# EAGLE schematic 5servoBreakoutSchematic (EAGLE 9.7.0)
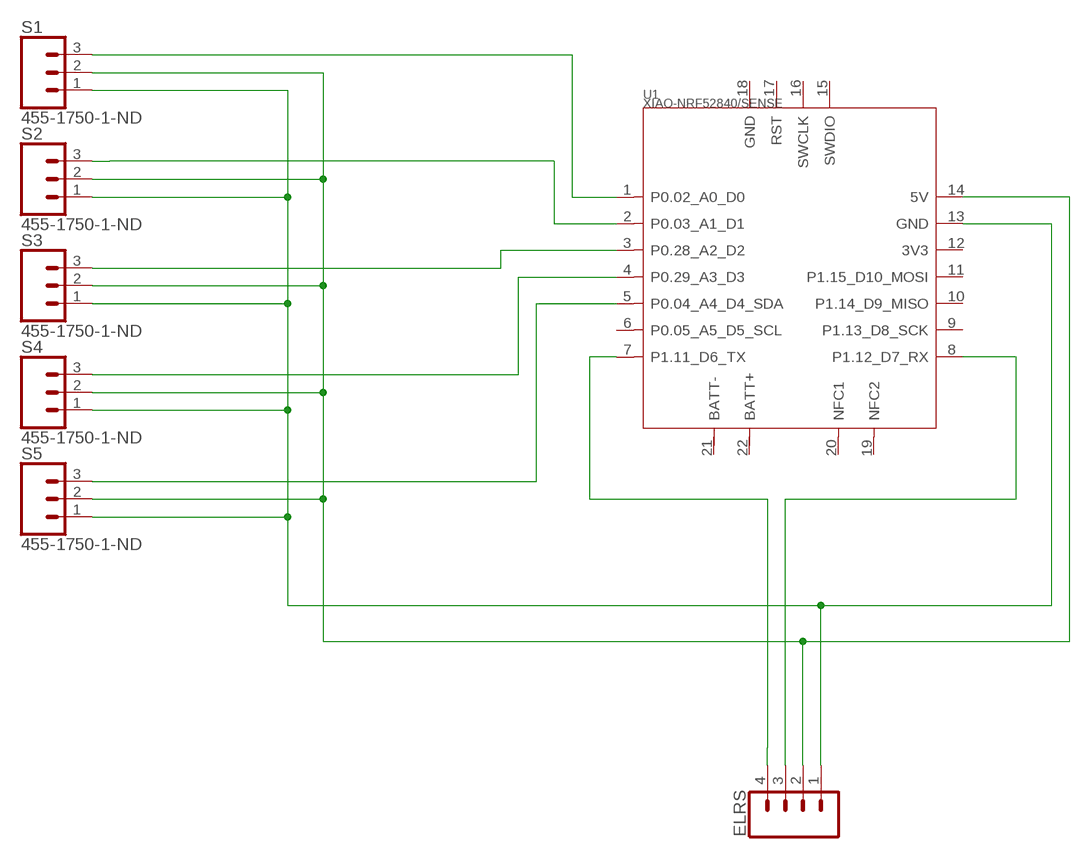
[diagram p0: schematic, sheet 1]

## Parts
ELRS  CONN_04PTH  [1X04]
S1  455-1750-1-ND  CONN_03  [1X03]
S2  455-1750-1-ND  CONN_03  [1X03]
S3  455-1750-1-ND  CONN_03  [1X03]
S4  455-1750-1-ND  CONN_03  [1X03]
S5  455-1750-1-ND  CONN_03  [1X03]
U1  XIAO-NRF52840/SENSE  [XIAO-NRF52840/SENSE-MODULE14P-2.54-21X17.8MM]

## Nets
5V [power]: ELRS.2 S1.2 S2.2 S3.2 S4.2 S5.2 U1.14(5V)
GND [power]: ELRS.1 S1.1 S2.1 S3.1 S4.1 S5.1 U1.13(GND)
N$1 [power]: S4.3 U1.4(P0.29_A3_D3)
N$2 [signal]: ELRS.3 U1.8(P1.12_D7_RX)
N$3 [signal]: ELRS.4 U1.7(P1.11_D6_TX)
N$4 [signal]: S1.3 U1.1(P0.02_A0_D0)
N$5 [signal]: S2.3 U1.2(P0.03_A1_D1)
N$6 [signal]: S3.3 U1.3(P0.28_A2_D2)
N$7 [power]: S5.3 U1.5(P0.04_A4_D4_SDA)
Unconnected: U1.6(P0.05_A5_D5_SCL) U1.9(P1.13_D8_SCK) U1.10(P1.14_D9_MISO) U1.11(P1.15_D10_MOSI) U1.12(3V3) U1.15(SWDIO) U1.16(SWCLK) U1.17(RST) U1.18(GND) U1.19(NFC2) U1.20(NFC1) U1.21(BATT-) U1.22(BATT+)

## Library data of the parts
ELRS = SparkFun-Connectors:CONN_04: Multi connection point. Often used as Generic Header-pin footprint for 0.1 inch spaced/style header connections On any of the 0.1 inch spaced packages, you can populate with these: Break Away Headers - Straight <https://www.sparkfun.com/products/116> (PRT-00116) Break Away Male Headers - Right Angle <https://www.sparkfun.com/products/553> (PRT-00553) Female Headers <https://www.sparkfun.com/products/115> (PRT-00115) Break Away Headers - Machine Pin <https://www.sparkfun.com/products/117> (PRT-00117) Break Away Female Headers - Swiss Machine Pin <https://www.sparkfun.com/products/743> (PRT-00743) For SCREWTERMINALS and SPRING TERMINALS visit here: Screw Terimnals on SparkFun.com <https://www.sparkfun.com/search/results?term=Screw+Terminals> (5mm/3.5mm/2.54mm spacing) This device is also useful as a general connection point to wire up your design to another part of your project. Our various solder wires solder well into these plated through hole pads. Hook-Up Wire - Assortment (Stranded, 22 AWG) <https://www.sparkfun.com/products/11375> (PRT-11375) Hook-Up Wire - Assortment (Solid Core, 22 AWG) <https://www.sparkfun.com/products/11367> (PRT-11367) View the entire wire category on our website here <https://www.sparkfun.com/categories/141> Special notes: Molex polarized connector foot print use with SKU : PRT-08231 with associated crimp pins and housings. 1MM SMD Version SKU: PRT-10208; PROD_ID: CONN-09696
S1-S5 = SparkFun-Connectors:CONN_03: Multi connection point. Often used as Generic Header-pin footprint for 0.1 inch spaced/style header connections On any of the 0.1 inch spaced packages, you can populate with these: Break Away Headers - Straight <https://www.sparkfun.com/products/116> (PRT-00116) Break Away Male Headers - Right Angle <https://www.sparkfun.com/products/553> (PRT-00553) Female Headers <https://www.sparkfun.com/products/115> (PRT-00115) Break Away Headers - Machine Pin <https://www.sparkfun.com/products/117> (PRT-00117) Break Away Female Headers - Swiss Machine Pin <https://www.sparkfun.com/products/743> (PRT-00743) Stackable Header - 3 Pin (Female, 0.1") <https://www.sparkfun.com/products/13875> (PRT-13875) For SCREWTERMINALS and SPRING TERMINALS visit here: Screw Terimnals on SparkFun.com <https://www.sparkfun.com/search/results?term=Screw+Terminals> (5mm/3.5mm/2.54mm spacing) This device is also useful as a general connection point to wire up your design to another part of your project. Our various solder wires solder well into these plated through hole pads. Hook-Up Wire - Assortment (Stranded, 22 AWG) <https://www.sparkfun.com/products/11375> (PRT-11375) Hook-Up Wire - Assortment (Solid Core, 22 AWG) <https://www.sparkfun.com/products/11367> (PRT-11367) View the entire wire category on our website here <https://www.sparkfun.com/categories/141> Special notes: Molex polarized connector foot print use with SKU : PRT-08232 with associated crimp pins and housings.; PROD_ID: XXX-00000
U1 = Seeed Studio XIAO Series:XIAO-NRF52840/SENSE: Seeed Studio XIAO nRF52840/Sense - Nordic nRF52840 BLE Microcontroller - 32-bit 64MHz ARM® Cortex® M4+ processor XIAO nRF52840 Seeed SKU: 102010448 Seeed Studio XIAO nRF52840 featuring Nordic nRF52840 MCU supports Bluetooth 5.0 & NFC and is Arduino-compatible. With its exquisite design, Bluetooth and built-in Type-C, it's perfect for TinyML, smart wearable devices, and IoT projects. Buy now <https://www.seeedstudio.com/Seeed-XIAO-BLE-nRF52840-p-5201.html> Wiki <https://wiki.seeedstudio.com/XIAO_BLE/> XIAO nRF52840 Sense Seeed SKU: 102010469 Seeed Studio XIAO nRF52840 Sense is a tiny Bluetooth BLE development board designed for IoT and AI applications. It features an onboard antenna, 6 Dof IMU, microphone, all of which make it an ideal board to run AI using TinyML and TensorFlow Lite. Buy now <https://www.seeedstudio.com/Seeed-XIAO-BLE-Sense-nRF52840-p-5253.html> Wiki <https://wiki.seeedstudio.com/XIAO_BLE/>

## Net classes
1 power: width 0.508 mm
2 signal: width 0.254 mm